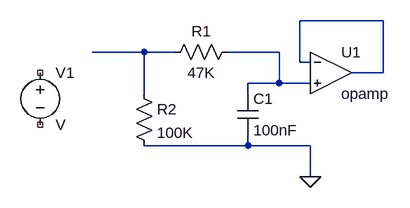
[diagram p0: schematic Draft1.asc]
Draft1.asc, the LTspice schematic file:
Version 4
SHEET 1 880 680
WIRE 288 96 160 96
WIRE -80 144 -160 144
WIRE -32 144 -80 144
WIRE 128 144 48 144
WIRE 160 160 160 96
WIRE 176 160 160 160
WIRE 288 176 288 96
WIRE 288 176 240 176
WIRE 128 192 128 144
WIRE 128 192 80 192
WIRE 176 192 128 192
WIRE -80 208 -80 144
WIRE 80 208 80 192
WIRE 80 288 80 272
WIRE 80 288 -80 288
WIRE 176 288 80 288
WIRE 176 336 176 288
FLAG 176 336 0
SYMBOL OpAmps\\opamp 208 112 R0
SYMATTR InstName U1
SYMBOL res 64 128 R90
WINDOW 0 0 56 VBottom 2
WINDOW 3 32 56 VTop 2
SYMATTR InstName R1
SYMATTR Value 47K
SYMBOL cap 64 208 R0
SYMATTR InstName C1
SYMATTR Value 100nF
SYMBOL res -96 192 R0
SYMATTR InstName R2
SYMATTR Value 100K
SYMBOL voltage -240 160 R0
SYMATTR InstName V1

The netlist it stands for:
* Draft1.asc
XU1 N001 N003 N001 opamp Aol=100K GBW=10Meg  ; pins invin noninvin out
R1 N003 N002 47K
C1 N003 0 100nF
R2 N002 0 100K
V1 NC_01 NC_02 V
.backanno
.end